# Altium schematic sheet Part12_USB_HUB.SchDoc
size A4
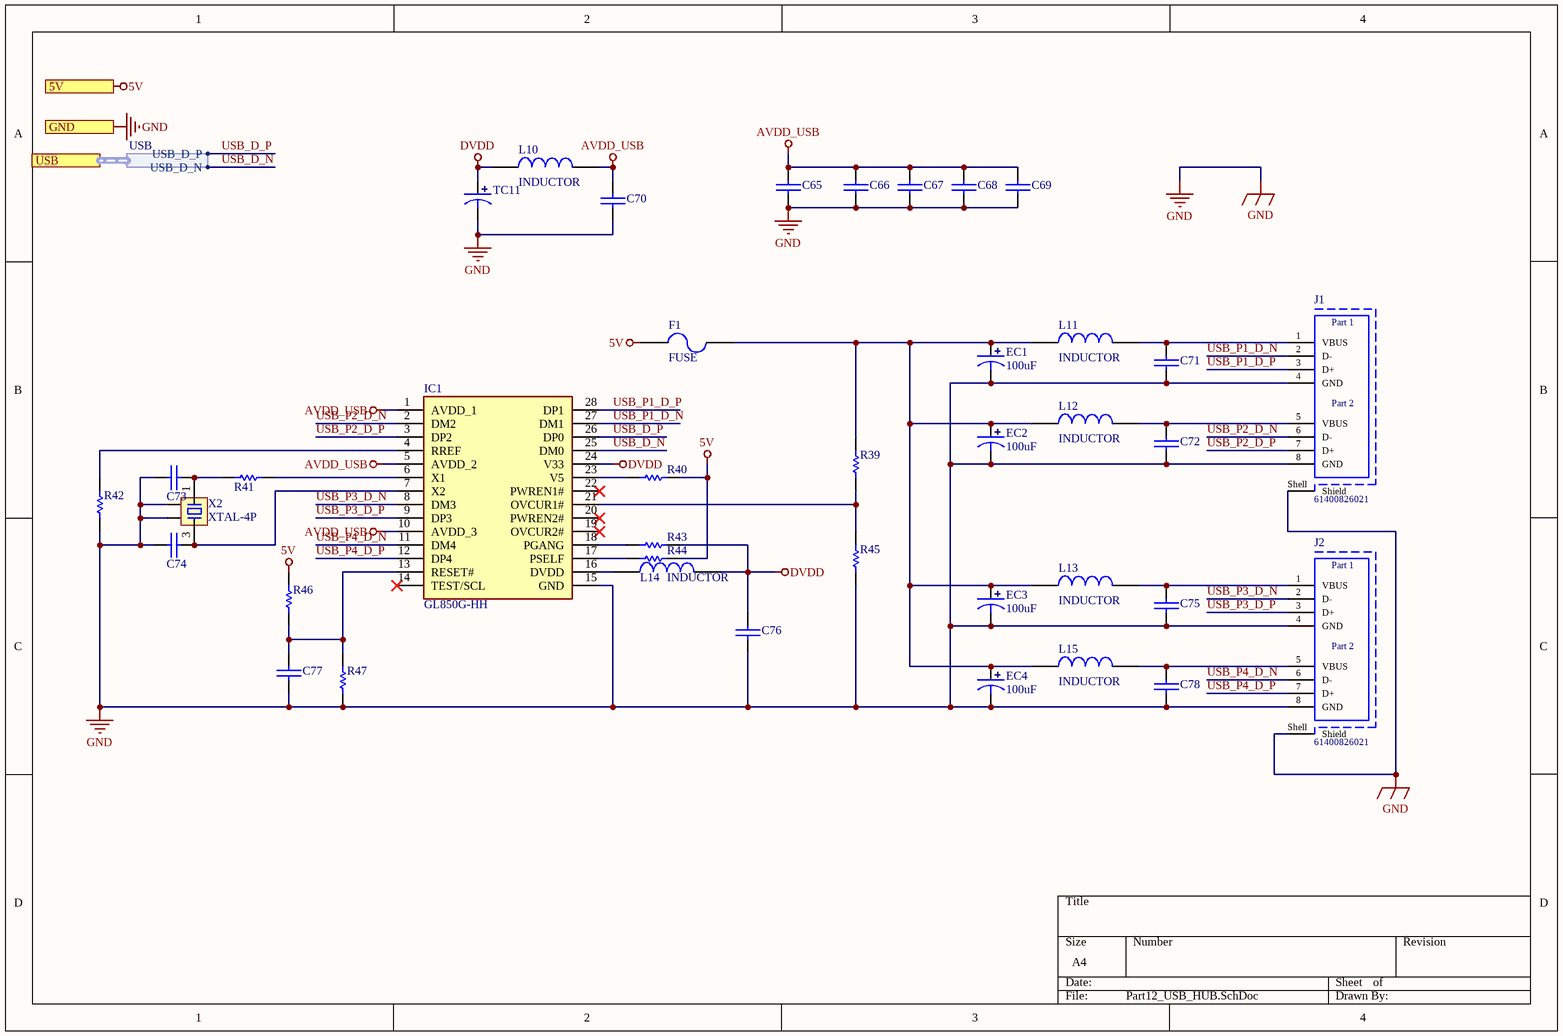
[diagram p0: Part12_USB_HUB.SchDoc]

## Parts
C65  100nF/16V  [0402C]  (value not drawn)
C66  100nF/16V  [0402C]  (value not drawn)
C67  1uF/16V  [0402C]  (value not drawn)
C68  1uF/16V  [0402C]  (value not drawn)
C69  100nF/16V  [0402C]  (value not drawn)
C70  100nF/16V  [0402C]  (value not drawn)
C71  100nF/16V  [0603C]  (value not drawn)
C72  100nF/16V  [0603C]  (value not drawn)
C73  20pF  [0402C]  (value not drawn)
C74  20pF  [0402C]  (value not drawn)
C75  100nF/16V  [0603C]  (value not drawn)
C76  100nF/16V  [0402C]  (value not drawn)
C77  1uF/16V  [0402C]  (value not drawn)
C78  100nF/16V  [0603C]  (value not drawn)
EC1  100uF  [SMD-EC4.0X4.3X5.4]
EC2  100uF  [SMD-EC4.0X4.3X5.4]
EC3  100uF  [SMD-EC4.0X4.3X5.4]
EC4  100uF  [SMD-EC4.0X4.3X5.4]
F1  FUSE  [FUSE-1210]
IC1  GL850G-HH  [SOP65P780X200-28N]
J1  61400826021  [61400826021]
J2  61400826021  [61400826021]
L10  INDUCTOR  [0603L]
L11  INDUCTOR  [0603L]
L12  INDUCTOR  [0603L]
L13  INDUCTOR  [0603L]
L14  INDUCTOR  [0603L]
L15  INDUCTOR  [0603L]
R39  30K  [0402R]  (value not drawn)
R40  0R  [0402R]  (value not drawn)
R41  0R  [0402R]  (value not drawn)
R42  680R / 1%  [0402R]  (value not drawn)
R43  100K  [0402R]  (value not drawn)
R44  10K  [0402R]  (value not drawn)
R45  30K  [0402R]  (value not drawn)
R46  10K  [0402R]  (value not drawn)
R47  47K  [0402R]  (value not drawn)
TC11  4.7uF/6.3V  [TAJ-A/3216]  (value not drawn)
X2  XTAL-4P  [OSC 3225-4P]

## Ports
5V, GND, USB (harness USB)

## Harnesses
USB: USB_D_P, USB_D_N

## Nets
5V: F1.1 R40.2 R44.2 R46.1 ; port 5V
AVDD_USB: C65.1 C66.1 C67.1 C68.1 C69.1 C70.1 IC1.1(AVDD_1) IC1.5(AVDD_2) IC1.10(AVDD_3) L10.2
DVDD: C76.1 IC1.24(V33) L10.1 L14.2 R43.2 TC11.1
GND: C65.2 C66.2 C67.2 C68.2 C69.2 C70.2 C71.2 C72.2 C73.1 C74.1 C75.2 C76.2 C77.2 C78.2 EC1.2 EC2.2 EC3.2 EC4.2 IC1.15(GND) J1.4(GND) J1.8(GND) J1.Shell(Shield) J2.4(GND) J2.8(GND) J2.Shell(Shield) R42.2 R45.2 R47.2 TC11.2 X2.2 X2.4 ; port GND
USB_D_N: IC1.25(DM0) ; port USB.USB_D_N
USB_D_P: IC1.26(DP0) ; port USB.USB_D_P
USB_P1_D_N: IC1.27(DM1) J1.2(D-)
USB_P1_D_P: IC1.28(DP1) J1.3(D+)
USB_P2_D_N: IC1.2(DM2) J1.6(D-)
USB_P2_D_P: IC1.3(DP2) J1.7(D+)
USB_P3_D_N: IC1.8(DM3) J2.2(D-)
USB_P3_D_P: IC1.9(DP3) J2.3(D+)
USB_P4_D_N: IC1.11(DM4) J2.6(D-)
USB_P4_D_P: IC1.12(DP4) J2.7(D+)
NetC71_1: C71.1 J1.1(VBUS) L11.2
NetC72_1: C72.1 J1.5(VBUS) L12.2
NetC73_2: C73.2 R41.1 X2.1
NetC74_2: C74.2 IC1.7(X2) X2.3
NetC75_1: C75.1 J2.1(VBUS) L13.2
NetC77_1: C77.1 IC1.13(RESET#) R46.2 R47.1
NetC78_1: C78.1 J2.5(VBUS) L15.2
NetEC1_1: EC1.1 EC2.1 EC3.1 EC4.1 F1.2 L11.1 L12.1 L13.1 L15.1 R39.1
NetIC1_4: IC1.4(RREF) R42.1
NetIC1_6: IC1.6(X1) R41.2
NetIC1_16: IC1.16(DVDD) L14.1
NetIC1_17: IC1.17(PSELF) R44.1
NetIC1_18: IC1.18(PGANG) R43.1
NetIC1_21: IC1.21(OVCUR1#) R39.2 R45.1
NetIC1_23: IC1.23(V5) R40.1

Not connected (* = marked no-connect by the designer): IC1 14(TEST/SCL)* 19(OVCUR2#)* 20(PWREN2#)* 22(PWREN1#)*

## Notes on the sheet
- (in symbol CMP-1502-03229-1) Part 1; Part 2

## Library data of the parts
C65-C78 = CAP: 无极性电容
EC1-EC4 = SMD_ECAP: 贴片电解电容
IC1 = GL850G-HH: Integrated Circuit; Manufacturer_Name: Genesys; Datasheet Link: https://www.kean.com.au/oshw/WR703N/GL850G%20USB%20Hub%201.07.pdf; Height: 2mm; Manufacturer_Part_Number: GL850G-HH; Arrow Part Number: GL850G-HH
J1 J2 = CMP-1502-03229-1: USB 2.0 Type A Receptacle WR-COM, Stacked Horizontal, THT; Manufacturer: Wurth Elektronik; Contact Resistance: 20mOhm; Rated Current: 1.5A; Working Voltage: 30VAC; Connector Type: USB2.0TypeA; Packaging: Tray; Package Reference: 61400826021; Mounting Technology: THT; Datasheet URL: https://katalog.we-online.de/em/datasheet/61400826021.pdf; Operating Temperature: -40to105degC; Gender: Receptacle; Orientation: StackedHorizontal; Part Number: 61400826021; Publisher: WurthElektronik; Manufacturer URL: http://www.we-online.de
R39-R47 = RES
TC11 = TCAP: 钽电容
X2 = XTAL-4P: 4脚无源晶振